# EAGLE design V4-MySensors-LoRa-V006 (EAGLE 9.1.1)
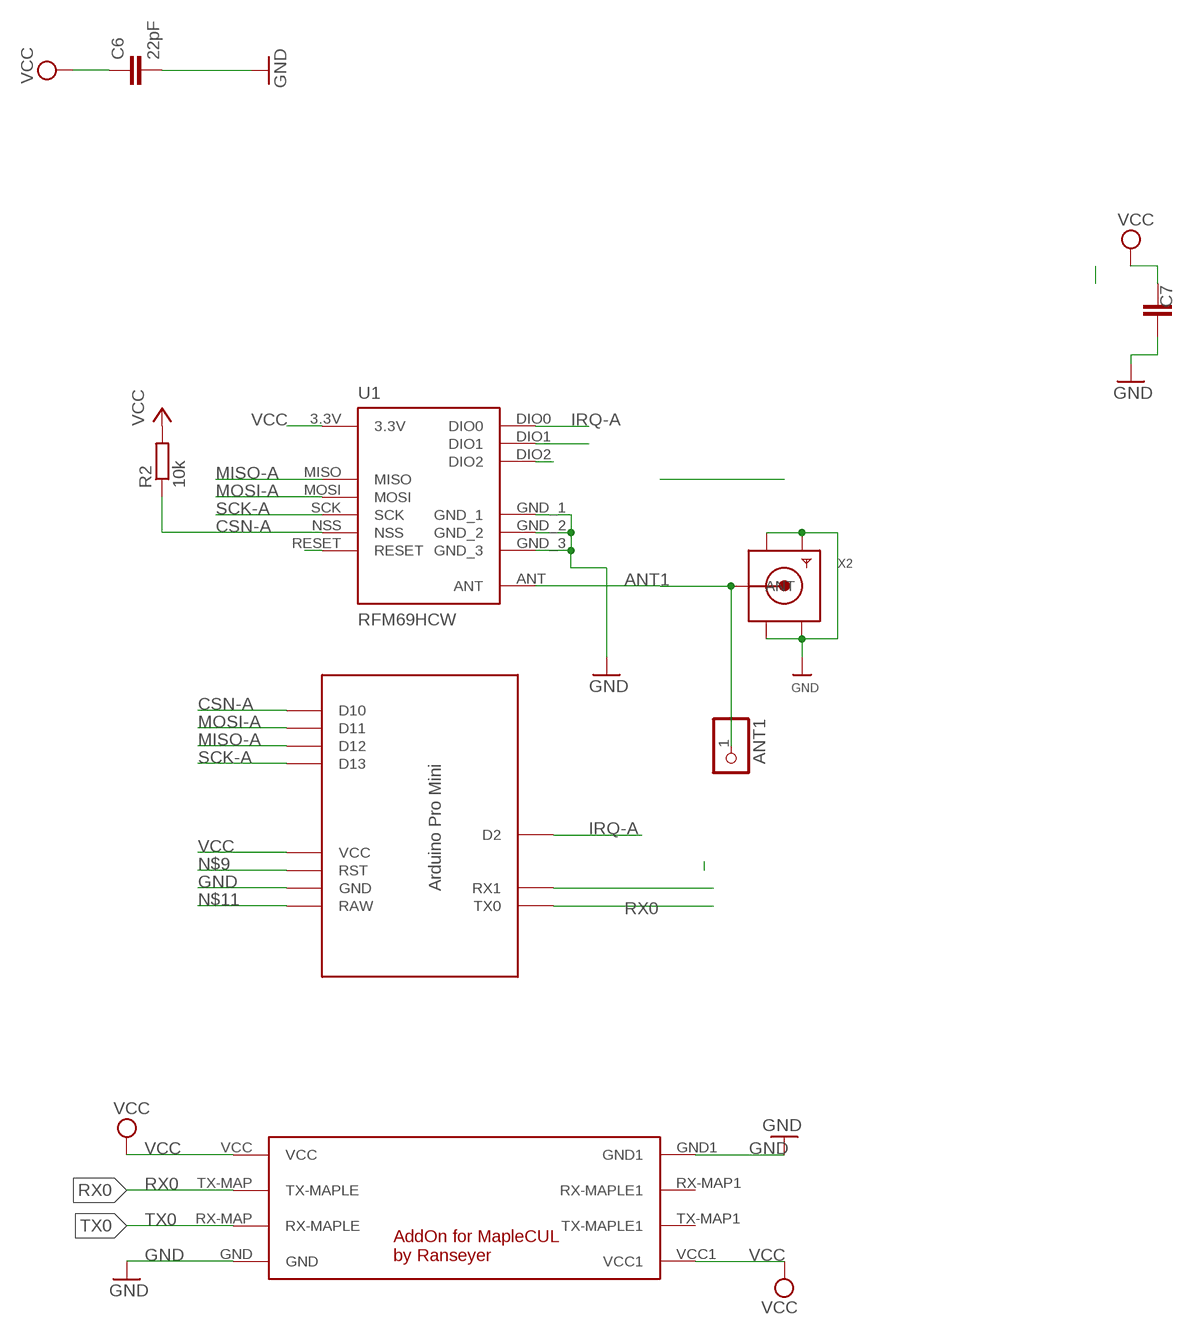
[diagram p0: schematic, sheet 1]

## Parts
ANT1  PINHD-1X1  [1X01]
C6  22pF  C-EUC0805  [C0805]
C7  C-EUC1812  [C1812]
R2  10k  R-EU_M0805  [M0805]
U1  RFM69HCW  [RFM69HCW-XXXS2]
U$1  MARTIN-PROMINI-SPI  [MARTIN-PRO-SPI]
U$2  MAPLE-CUL-ADDON-V01  [MAPLE-CUL-V01]
X2  SMACONNECTOR_EDGE  [SMA_EDGELAUNCH]

## Nets
ANT1: ANT1.1 U1.ANT X2.P(ANT)
CSN-A: R2.1 U1.NSS U$1.D10
GND [PWR]: C6.2 C7.1 U1.GND_1 U1.GND_2 U1.GND_3 U$1.GND U$2.GND U$2.GND1 X2.GND@1(GND4) X2.GND@2(GND3) X2.GND@3(GND2) X2.GND@4(GND1)
IRQ-A: U1.DIO0 U$1.D2
MISO-A: U1.MISO U$1.D12
MOSI-A: U1.MOSI U$1.D11
N$3: U1.RESET
N$9: U$1.RST
N$11: U$1.RAW
N$14: U1.DIO2
N$15: U1.DIO1
RX0: U$1.TX0 U$2.TX-MAP(TX-MAPLE)
SCK-A: U1.SCK U$1.D13
TX0: U$1.RX1 U$2.RX-MAP(RX-MAPLE)
VCC [PWR]: C6.1 C7.2 R2.2 U1.3.3V U$1.VCC U$2.VCC U$2.VCC1
Unconnected: U$2.RX-MAP1(RX-MAPLE1) U$2.TX-MAP1(TX-MAPLE1)

## Library data of the parts
ANT1 = pinhead:PINHD-1X1: PIN HEADER
C6 C7 = rcl:C-EU: CAPACITOR, European symbol; SPICEPREFIX: C
R2 = rcl:R-EU_: RESISTOR, European symbol
U1 = doug:RFM69H
U$1 = Arduino-clone:MARTIN-PROMINI-SPI
U$2 = Martin-Communication-V4:MAPLE-CUL-ADDON-V01: AddOn for MAPLE-CUL V4.x
X2 = adafruit:SMACONNECTOR: SMA Connector 90° DIP SMA Connector, 50 Ohm (4UConnector: 07259)

## Net classes
0 default: width 0.406 mm
1 PWR: width 0.914 mm

## Board
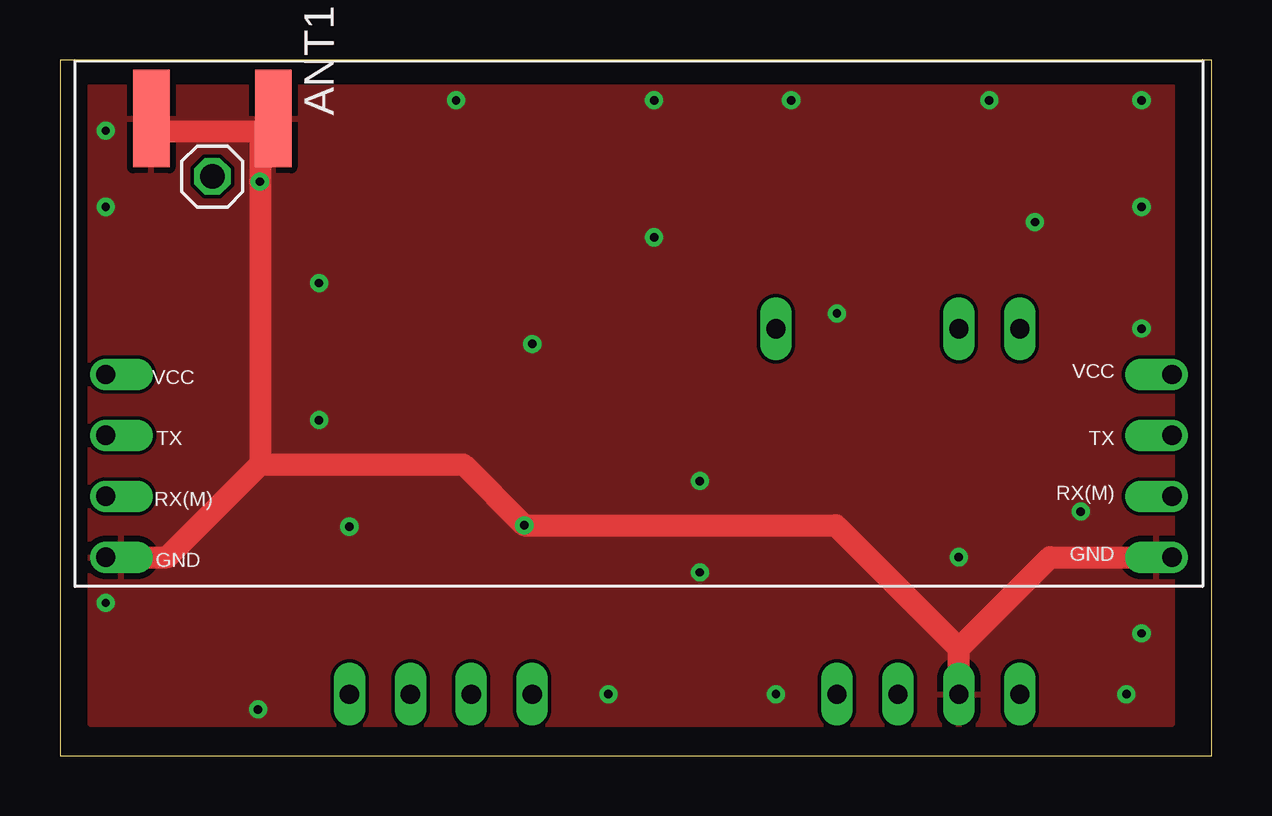
[diagram p1: board, top side]
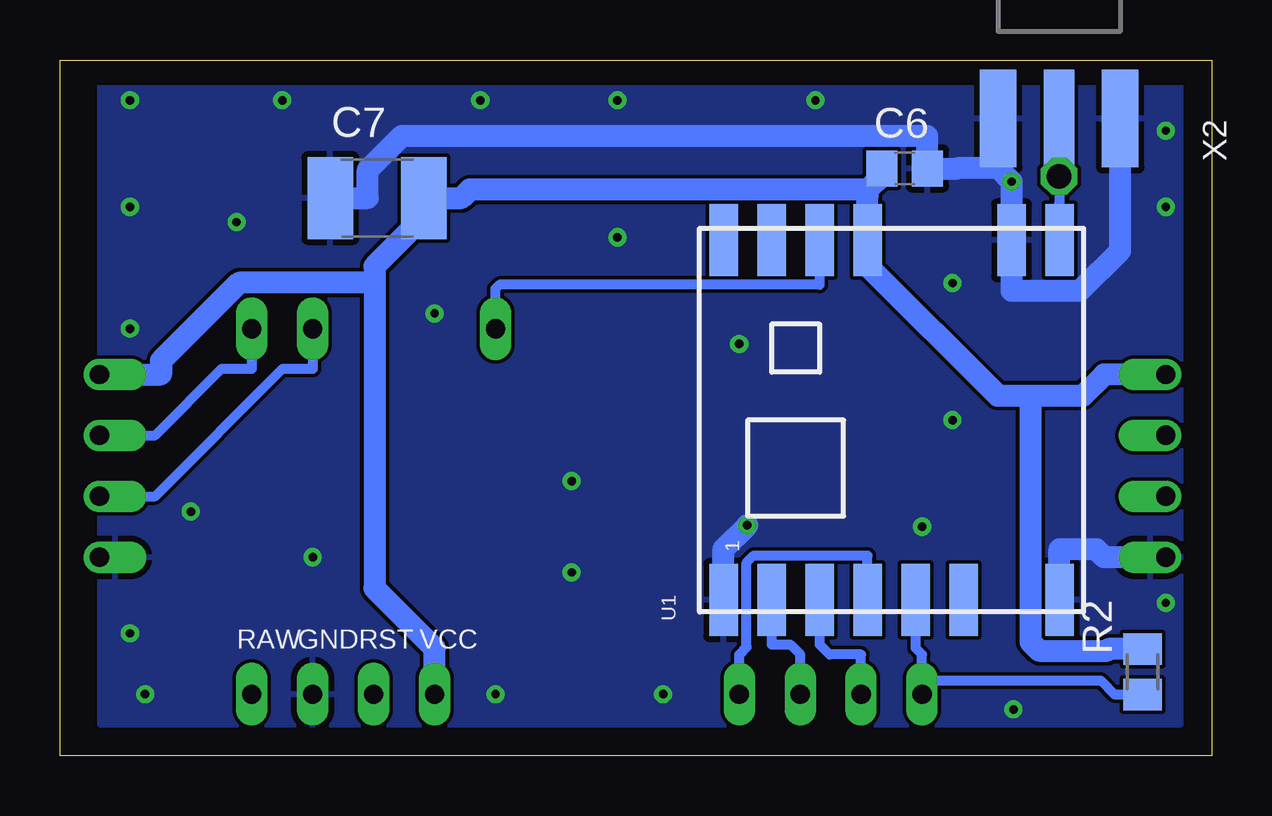
[diagram p2: board, bottom side, seen from below]

Size 48 x 29 mm. Coordinates in mm from the lower left corner, seen from the top.
Outline: 0,0 48,0 48,29 0,29 0,0
Copper layers (1*16): Top 0.035mm / dielectric 1.5mm / Bottom 0.035mm
Design rules "default": minimum track width 6mil, minimum drill 0.35mm, track to track 6mil, track to pad 6mil, pad to pad 6mil, via to via 6mil, smd to smd 6mil, copper to edge 40mil, drill to drill 6mil, minimum pad ring 10mil, minimum via ring 8mil, stop-mask expansion 4mil, vias tented up to drill 0mil, thermal gap 10mil

### Footprints (pad centres in the part's own frame; a part is rotated, then mirrored left to right if it is on the bottom)
1X01 = drill 1.016 octagon: 1 0,0
C0805 = smd 1.3 x 1.5: 1 -0.95,0; 2 0.95,0
C1812 = smd 1.9 x 3.4: 1 -1.95,0; 2 1.95,0
M0805 = smd 1.3 x 1.6: 1 -0.95,0; 2 0.95,0
RFM69HCW-XXXS2 = smd 3 x 1.2: 3.3V 7.5,1; ANT 7.5,-7; DIO0 7.5,3; DIO1 7.5,5; DIO2 7.5,7; GND_1 7.5,-5; GND_2 -7.5,-7; GND_3 -7.5,7; MISO -7.5,5; MOSI -7.5,3; NSS -7.5,-1; RESET -7.5,-3; SCK -7.5,1
MARTIN-PRO-SPI = drill 0.8 long: D2 -5.08,-3.81; D10 10.16,-21.59; D11 10.16,-19.05; D12 10.16,-16.51; D13 10.16,-13.97; GND 10.16,3.81; RAW 10.16,6.35; RST 10.16,1.27; RX1 -5.08,3.81; TX0 -5.08,6.35; VCC 10.16,-1.27
MAPLE-CUL-V01 = drill 0.8 offset: GND 1.27,12.7; GND1 45.72,12.7; RX-MAP 1.27,10.16; RX-MAP1 45.72,10.16; TX-MAP 1.27,7.62; TX-MAP1 45.72,7.62; VCC 1.27,5.08; VCC1 45.72,5.08
SMA_EDGELAUNCH = smd 4.064 x 1.524: GND@1 2.032,-2.54; GND@2 2.032,2.54 | smd 4.064 x 1.524 bottom: GND@3 2.032,2.54; GND@4 2.032,-2.54 | smd 4.064 x 1.27: P 2.032,0

### Placement (x,y rotation side)
ANT1  6.35,24.14 0 top
C6  12.79,24.48 0 bottom
C7  34.78,23.24 0 bottom
R2  2.87,3.49 90 bottom
U1  13.34,13.98 90 bottom
U$1  33.66,12.71 270 top
U$2  47.62,20.97 180 top
X2  6.35,28.59 270 bottom

### Tracks (layer width: path | path; a pad name or v marks a point on that pad's centre or on a via)
ANT1
  Bottom 0.406: U1.ANT 6.33,23.01 6.35,23.03 ANT1.1 X2.P
CSN-A
  Bottom 0.406: R2.1 4.03,2.54 4.62,3.13 12.06,3.13 | 12.06,3.13 12.06,4.22 12.34,4.49 U1.NSS | U$1.D10 12.06,3.13
GND  (via drill 0.35 pad 0.76)
  Top 0.914: 37.47,4.47 32.34,9.6 v19.35,9.6 16.82,12.13 8.34,12.13 | 8.34,12.13 4.48,8.27 U$2.GND1 | 8.34,12.13 v8.34,23.93 8.34,26 | 8.34,26 X2.GND@1 | 8.34,26 4.37,26 X2.GND@2 | 37.47,4.47 41.26,8.27 U$2.GND | U$1.GND 37.47,4.47
  Bottom 0.914: U1.GND_3 20.34,8.62 v19.35,9.6 | X2.GND@2 3.81,21.05 5.48,19.38 8.34,19.38 U1.GND_1 v8.34,23.93 8.89,24.48 | U$2.GND1 4.48,8.27 4.8,8.6 6.33,8.6 U1.GND_2 | C7.1 35.17,23.24 35.17,24.41 33.75,25.84 11.85,25.84 C6.2 10.59,24.48 10.58,24.48 8.89,24.48 | X2.GND@1 8.89,24.48
  other vias: 1.91,6.37 22.86,2.55 29.84,2.55 26.67,7.63 26.67,11.45 10.79,13.98 10.79,19.7 1.91,22.88 1.91,26.05 16.51,27.32 45.09,27.32 38.73,27.32 30.48,27.32 24.77,27.32 40.64,22.24 45.09,22.88 45.09,17.8 42.55,10.18 44.45,2.55 45.09,5.09 37.47,8.27 32.38,18.43 24.77,21.61 19.68,17.16 12.06,9.54 8.26,1.92
  pour Bottom: 1.27,1.29 1.27,27.95 46.35,27.95 46.35,1.29
  pour Top: 1.27,1.29 1.27,27.95 46.35,27.95 46.35,1.29
IRQ-A
  Bottom 0.406: U$1.D2 29.84,19.46 29.67,19.63 16.34,19.63 U1.DIO0
MISO-A
  Bottom 0.406: U1.MISO 18.34,4.63 17.56,4.63 17.14,4.22 U$1.D12
MOSI-A
  Bottom 0.406: U1.MOSI 16.34,4.63 15.92,4.22 14.61,4.22 U$1.D11
RX0
  Bottom 0.406: U$1.TX0 40.01,16.13 41.26,16.13 44.04,13.35 U$2.TX-MAP
SCK-A
  Bottom 0.406: U1.SCK 14.34,8.34 19.08,8.34 19.38,8.04 19.38,4.52 19.68,4.22 U$1.D13
TX0
  Bottom 0.406: U$1.RX1 37.47,16.13 38.72,16.13 44.04,10.81 U$2.RX-MAP
VCC
  Bottom 0.914: U$2.VCC1 4.48,15.89 5.36,15.01 7.55,15.01 | 7.55,15.01 8.91,15.01 14.34,20.43 U1.3.3V 14.34,23.33 14.34,23.59 | 7.55,15.01 7.55,4.73 7.18,4.37 4.35,4.37 4.28,4.44 R2.2 | 34.89,19.71 34.89,6.98 32.38,4.47 U$1.VCC | 32.05,23.24 34.89,20.4 34.89,19.71 | 34.89,19.71 40.53,19.71 43.78,16.46 43.78,15.89 U$2.VCC | 32.05,23.24 31.27,23.24 30.92,23.59 14.34,23.59 | C7.2 32.05,23.24 | 14.34,23.59 13.74,24.18 C6.1

### Text on the board
bNames: VCC | RST | GND | RAW